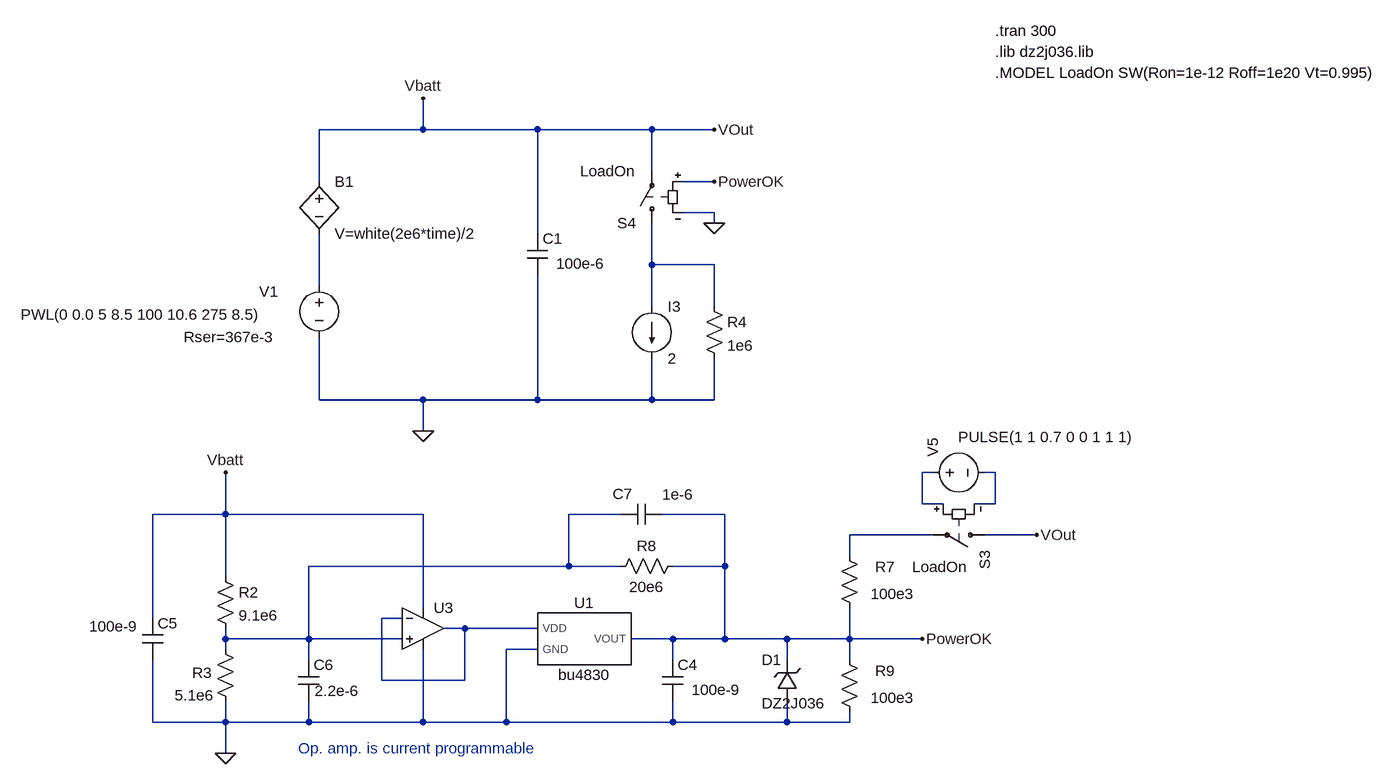
[diagram p0: schematic WhiskersSWControl.asc]
WhiskersSWControl.asc, the LTspice schematic file:
Version 4
SHEET 1 3812 932
WIRE -960 -176 -960 -224
WIRE -960 -176 -1120 -176
WIRE -784 -176 -960 -176
WIRE -608 -176 -784 -176
WIRE -512 -176 -608 -176
WIRE -608 -112 -608 -176
WIRE -1120 -96 -1120 -176
WIRE -512 -96 -560 -96
WIRE -512 -48 -560 -48
WIRE -512 -32 -512 -48
WIRE -784 -16 -784 -176
WIRE -608 32 -608 -32
WIRE -512 32 -608 32
WIRE -1120 64 -1120 -16
WIRE -608 96 -608 32
WIRE -512 96 -512 32
WIRE -1120 240 -1120 144
WIRE -960 240 -1120 240
WIRE -784 240 -784 48
WIRE -784 240 -960 240
WIRE -608 240 -608 176
WIRE -608 240 -784 240
WIRE -512 240 -512 176
WIRE -512 240 -608 240
WIRE -960 288 -960 240
WIRE -176 352 -192 352
WIRE -80 352 -96 352
WIRE -192 400 -192 352
WIRE -160 400 -192 400
WIRE -80 400 -80 352
WIRE -80 400 -112 400
WIRE -1264 416 -1264 352
WIRE -1264 416 -1376 416
WIRE -960 416 -1264 416
WIRE -656 416 -736 416
WIRE -496 416 -592 416
WIRE -176 448 -304 448
WIRE -16 448 -96 448
WIRE -304 480 -304 448
WIRE -736 496 -736 416
WIRE -736 496 -1136 496
WIRE -656 496 -736 496
WIRE -496 496 -496 416
WIRE -496 496 -576 496
WIRE -1264 512 -1264 416
WIRE -960 560 -960 416
WIRE -1376 576 -1376 416
WIRE -992 576 -1024 576
WIRE -896 592 -928 592
WIRE -784 592 -896 592
WIRE -1264 608 -1264 592
WIRE -1136 608 -1136 496
WIRE -1136 608 -1264 608
WIRE -992 608 -1136 608
WIRE -576 608 -640 608
WIRE -496 608 -496 496
WIRE -496 608 -576 608
WIRE -400 608 -496 608
WIRE -304 608 -304 560
WIRE -304 608 -400 608
WIRE -192 608 -304 608
WIRE -1264 624 -1264 608
WIRE -784 624 -832 624
WIRE -1136 640 -1136 608
WIRE -576 640 -576 608
WIRE -400 640 -400 608
WIRE -304 640 -304 608
WIRE -1024 672 -1024 576
WIRE -896 672 -896 592
WIRE -896 672 -1024 672
WIRE -1376 736 -1376 640
WIRE -1264 736 -1264 704
WIRE -1264 736 -1376 736
WIRE -1136 736 -1136 704
WIRE -1136 736 -1264 736
WIRE -960 736 -960 624
WIRE -960 736 -1136 736
WIRE -832 736 -832 624
WIRE -832 736 -960 736
WIRE -576 736 -576 704
WIRE -576 736 -832 736
WIRE -400 736 -400 704
WIRE -400 736 -576 736
WIRE -304 736 -304 720
WIRE -304 736 -400 736
WIRE -1264 784 -1264 736
FLAG -1264 784 0
FLAG -960 -224 Vbatt
FLAG -1264 352 Vbatt
FLAG -16 448 VOut
FLAG -192 608 PowerOK
FLAG -512 -32 0
FLAG -512 -96 PowerOK
FLAG -960 288 0
FLAG -512 -176 VOut
SYMBOL cap -800 -16 R0
WINDOW 3 45 46 Left 2
SYMATTR Value 100e-6
SYMATTR InstName C1
SYMBOL res -1280 496 R0
SYMATTR InstName R2
SYMATTR Value 9.1e6
SYMBOL res -1280 608 R0
WINDOW 0 -35 52 Left 2
WINDOW 3 -62 87 Left 2
SYMATTR InstName R3
SYMATTR Value 5.1e6
SYMBOL zener -384 704 R180
WINDOW 0 24 64 Left 2
WINDOW 3 -43 -3 Left 2
SYMATTR InstName D1
SYMATTR Value DZ2J036
SYMATTR Prefix X
SYMBOL bu4830 -704 608 M0
SYMATTR InstName U1
SYMBOL cap -592 640 R0
WINDOW 3 45 46 Left 2
SYMATTR Value 100e-9
SYMATTR InstName C4
SYMATTR SpiceLine IC=0
SYMBOL voltage -192 352 R270
WINDOW 3 55 55 VRight 2
WINDOW 123 0 0 Left 0
WINDOW 39 0 0 Left 0
SYMATTR Value PULSE(1 1 0.7 0 0 1 1 1)
SYMATTR InstName V5
SYMBOL sw -80 448 R90
WINDOW 3 49 41 VRight 2
SYMATTR Value LoadOn
SYMATTR InstName S3
SYMBOL res -288 736 R180
WINDOW 0 -54 79 Left 2
WINDOW 3 -84 37 Left 2
SYMATTR InstName R9
SYMATTR Value 100e3
SYMBOL Opamps\\UniversalOpamp2 -960 592 R0
SYMATTR InstName U3
SYMATTR Value2 Avol=0.1Meg GBW=0.1Meg Slew=40000
SYMATTR SpiceLine ilimit=50m rail=0 Vos=0 phimargin=35
SYMBOL cap -1392 576 R0
WINDOW 3 -82 13 Left 2
SYMATTR Value 100e-9
SYMATTR InstName C5
SYMBOL res -288 576 R180
WINDOW 0 -54 79 Left 2
WINDOW 3 -84 37 Left 2
SYMATTR InstName R7
SYMATTR Value 100e3
SYMBOL res -560 480 R90
WINDOW 0 0 56 VBottom 2
WINDOW 3 32 56 VTop 2
SYMATTR InstName R8
SYMATTR Value 20e6
SYMBOL sw -608 -16 R180
SYMATTR InstName S4
SYMATTR Value LoadOn
SYMBOL current -608 96 R0
WINDOW 123 0 0 Left 0
WINDOW 39 0 0 Left 0
SYMATTR InstName I3
SYMATTR Value 2
SYMBOL res -528 80 R0
SYMATTR InstName R4
SYMATTR Value 1e6
SYMBOL voltage -1120 48 R0
WINDOW 123 0 0 Left 0
WINDOW 39 -208 95 Left 2
WINDOW 0 -92 25 Left 2
WINDOW 3 -459 61 Left 2
SYMATTR SpiceLine Rser=367e-3
SYMATTR InstName V1
SYMATTR Value PWL(0 0.0 5 8.5 100 10.6 275 8.5)
SYMBOL cap -1152 640 R0
WINDOW 3 25 48 Left 2
SYMATTR Value 2.2e-6
SYMATTR InstName C6
SYMBOL bv -1120 -112 R0
SYMATTR InstName B1
SYMATTR Value V=white(2e6*time)/2
SYMBOL cap -592 400 R90
WINDOW 3 -30 -24 VTop 2
WINDOW 0 0 61 VBottom 2
SYMATTR Value 1e-6
SYMATTR InstName C7
TEXT -80 -264 Left 2 !.MODEL LoadOn SW(Ron=1e-12 Roff=1e20 Vt=0.995)
TEXT -80 -328 Left 2 !.tran 300
TEXT -80 -296 Left 2 !.lib dz2j036.lib
TEXT -1152 776 Left 2 ;Op. amp. is current programmable

The netlist it stands for:
* WhiskersSWControl.asc
C1 VOut 0 100e-6
R2 VOut N005 9.1e6
R3 N005 0 5.1e6
XD1 0 PowerOK DZ2J036  ; pins + -
XU1 PowerOK N007 0 bu4830  ; pins VOUT VDD GND
C4 PowerOK 0 100e-9 IC=0
V5 N003 N004 PULSE(1 1 0.7 0 0 1 1 1)
S3 VOut N006 N003 N004 LoadOn
R9 0 PowerOK 100e3
XU3 N005 N007 VOut 0 N007 level.2 Avol=0.1Meg GBW=0.1Meg Slew=40000 ilimit=50m rail=0 Vos=0 phimargin=35 en=0 enk=0 in=0 ink=0 Rin=500Meg  ; pins IN+ IN- V+ V- OUT
C5 VOut 0 100e-9
R7 PowerOK N006 100e3
R8 PowerOK N005 20e6
S4 N001 VOut PowerOK 0 LoadOn
I3 N001 0 2
R4 N001 0 1e6
V1 N002 0 PWL(0 0.0 5 8.5 100 10.6 275 8.5) Rser=367e-3
C6 N005 0 2.2e-6
B1 VOut N002 V=white(2e6*time)/2
C7 PowerOK N005 1e-6
.MODEL LoadOn SW(Ron=1e-12 Roff=1e20 Vt=0.995)
.tran 300
.lib dz2j036.lib
* Op. amp. is current programmable
.lib BU4830.LIB
.lib UniversalOpamps2.sub
.backanno
.end